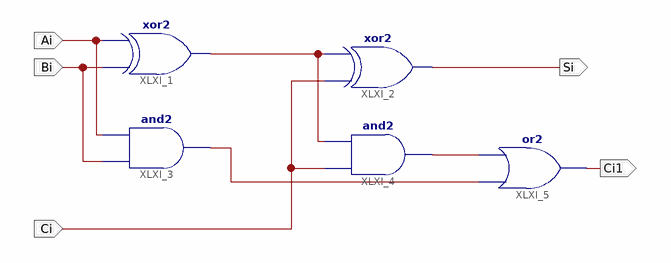
[diagram p0: schematic sheet 1]
// Xilinx ISE schematic FA.sch (spartan3e) as structural Verilog: 5 symbols, 5 ports
module FA (
  input  Ai,
  input  Bi,
  input  Ci,
  output Si,
  output Ci1
);

  wire XLXN_9, XLXN_10, XLXN_11;

  xor XLXI_1 (XLXN_11, Bi, Ai);
  xor XLXI_2 (Si, Ci, XLXN_11);
  and XLXI_3 (XLXN_10, Bi, Ai);
  and XLXI_4 (XLXN_9, Ci, XLXN_11);
  or XLXI_5 (Ci1, XLXN_10, XLXN_9);
endmodule
